# EAGLE design senior_design (EAGLE 8.4.3)
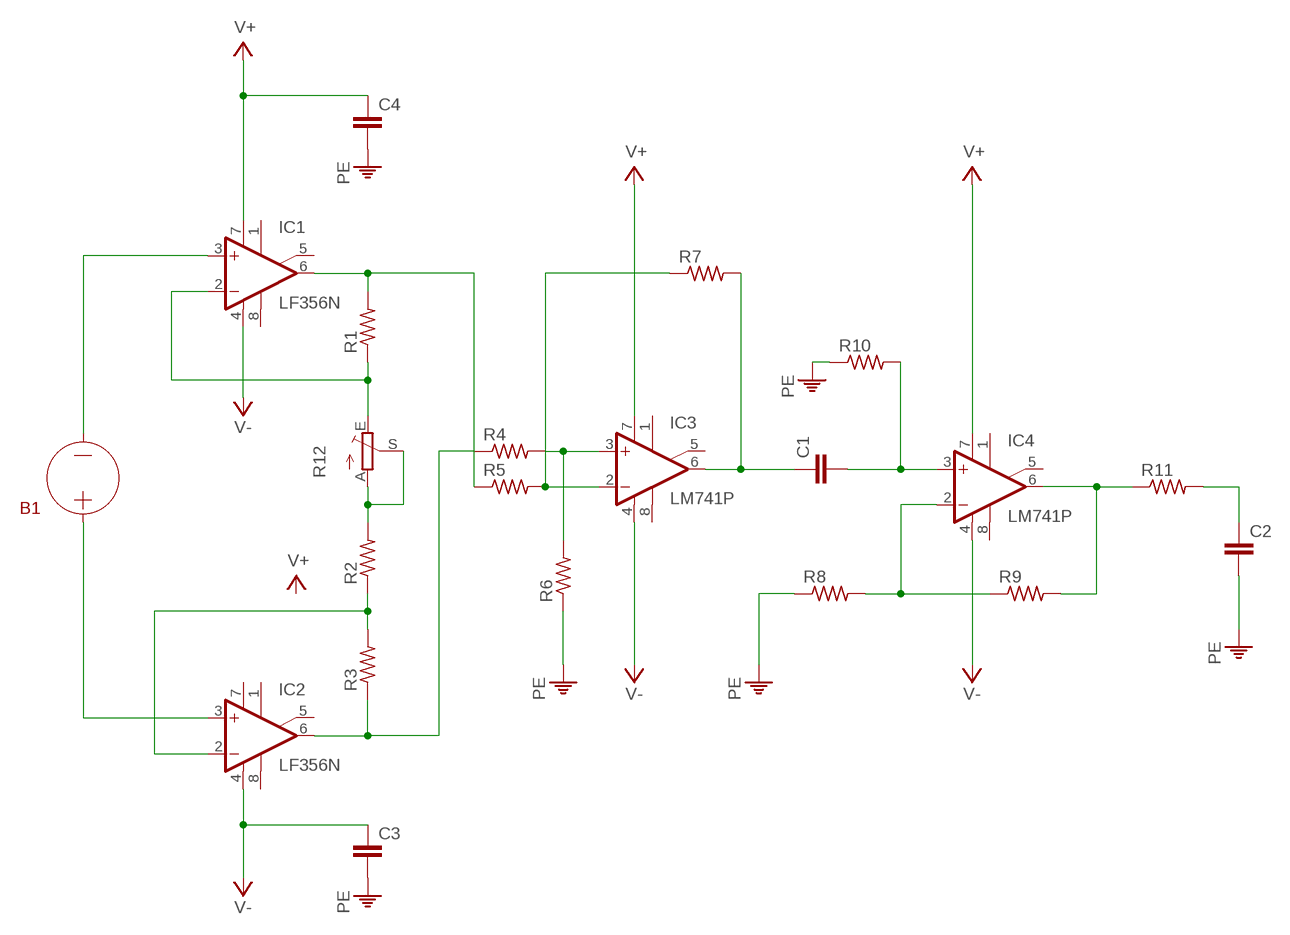
[diagram p0: schematic, sheet 1]

## Parts
B1  NONLIN_ASRC  (no package)
C1  C2,5-3  [C2.5-3]
C2  C2,5-3  [C2.5-3]
C3  C2,5-3  [C2.5-3]
C4  C2,5-3  [C2.5-3]
IC1  LF356N  [DIL08]
IC2  LF356N  [DIL08]
IC3  LM741P  [DIL08]
IC4  LM741P  [DIL08]
R1  R-US_0204/7  [0204/7]
R2  R-US_0204/7  [0204/7]
R3  R-US_0204/7  [0204/7]
R4  R-US_0204/7  [0204/7]
R5  R-US_0204/7  [0204/7]
R6  R-US_0204/7  [0204/7]
R7  R-US_0204/7  [0204/7]
R8  R-US_0204/7  [0204/7]
R9  R-US_0204/7  [0204/7]
R10  R-US_0204/7  [0204/7]
R11  R-US_0204/7  [0204/7]
R12  TRIM_EU-B25X  [B25X]

## Nets
N$1: B1.- IC1.3(+IN)
N$2: B1.+ IC2.3(+IN)
N$3: IC1.6(OUT) R1.2 R5.1
N$4: IC1.2(-IN) R1.1 R12.E
N$5: IC2.6(OUT) R3.1 R4.1
N$6: IC2.2(-IN) R2.1 R3.2
N$7: IC3.3(+IN) R4.2 R6.2
N$8: IC3.2(-IN) R5.2 R7.1
N$9: C2.1 R11.2
N$10: C1.2 IC4.3(+IN) R10.2
N$11: C1.1 IC3.6(OUT) R7.2
N$12: IC4.2(-IN) R8.2 R9.1
N$13: IC4.6(OUT) R9.2 R11.1
N$17: R2.2 R12.A R12.S
V+: C4.1 IC1.7(V+) IC3.7(V+) IC4.7(V+)
V-: C3.1 IC1.4(V-) IC2.4(V-) IC3.4(V-) IC4.4(V-)
VO: C2.2 C3.2 C4.2 R6.1 R8.1 R10.1 ; supply symbol labelled PE
Unconnected: IC1.1(ON1) IC1.5(ON2) IC1.8(OPT) IC2.1(ON1) IC2.5(ON2) IC2.8(OPT) IC3.1(ON1) IC3.5(ON2) IC3.8(OPT) IC4.1(ON1) IC4.5(ON2) IC4.8(OPT)

## Power pins joined to a net without a drawn wire
V+: IC2.7(V+)

## Library data of the parts
B1 = ngspice-simulation:NONLIN_ASRC: Nonlinear dependent source (ASRC) BXXXXXXX n+ n− < i = e x p r > <v= e x p r > < t c 1 = v al u e > < t c 2 = v al u e ><temp= v al u e > <dtemp= v al u e >
C1-C4 = capacitor-wima:C: CAPACITOR naming: grid - package width
IC1 IC2 = linear:LF356: OP AMP
IC3 IC4 = linear:*741: OP AMP
R1-R11 = rcl:R-US_: RESISTOR, American symbol
R12 = pot:TRIM_EU-: POTENTIOMETER

## Board
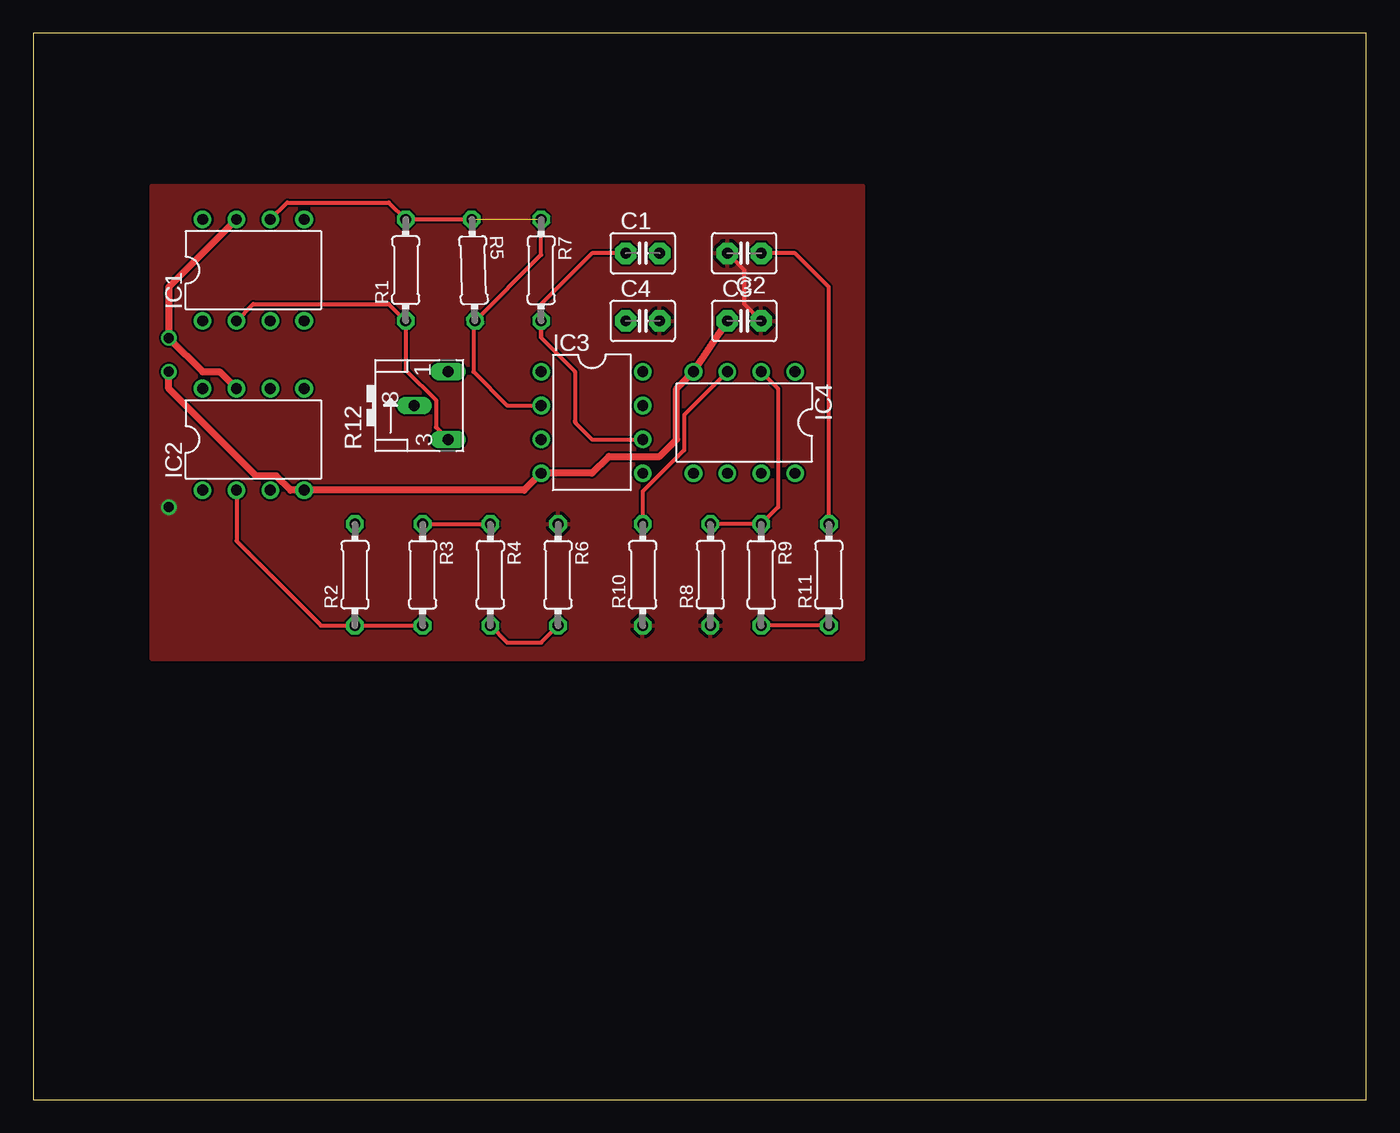
[diagram p1: board, top side]
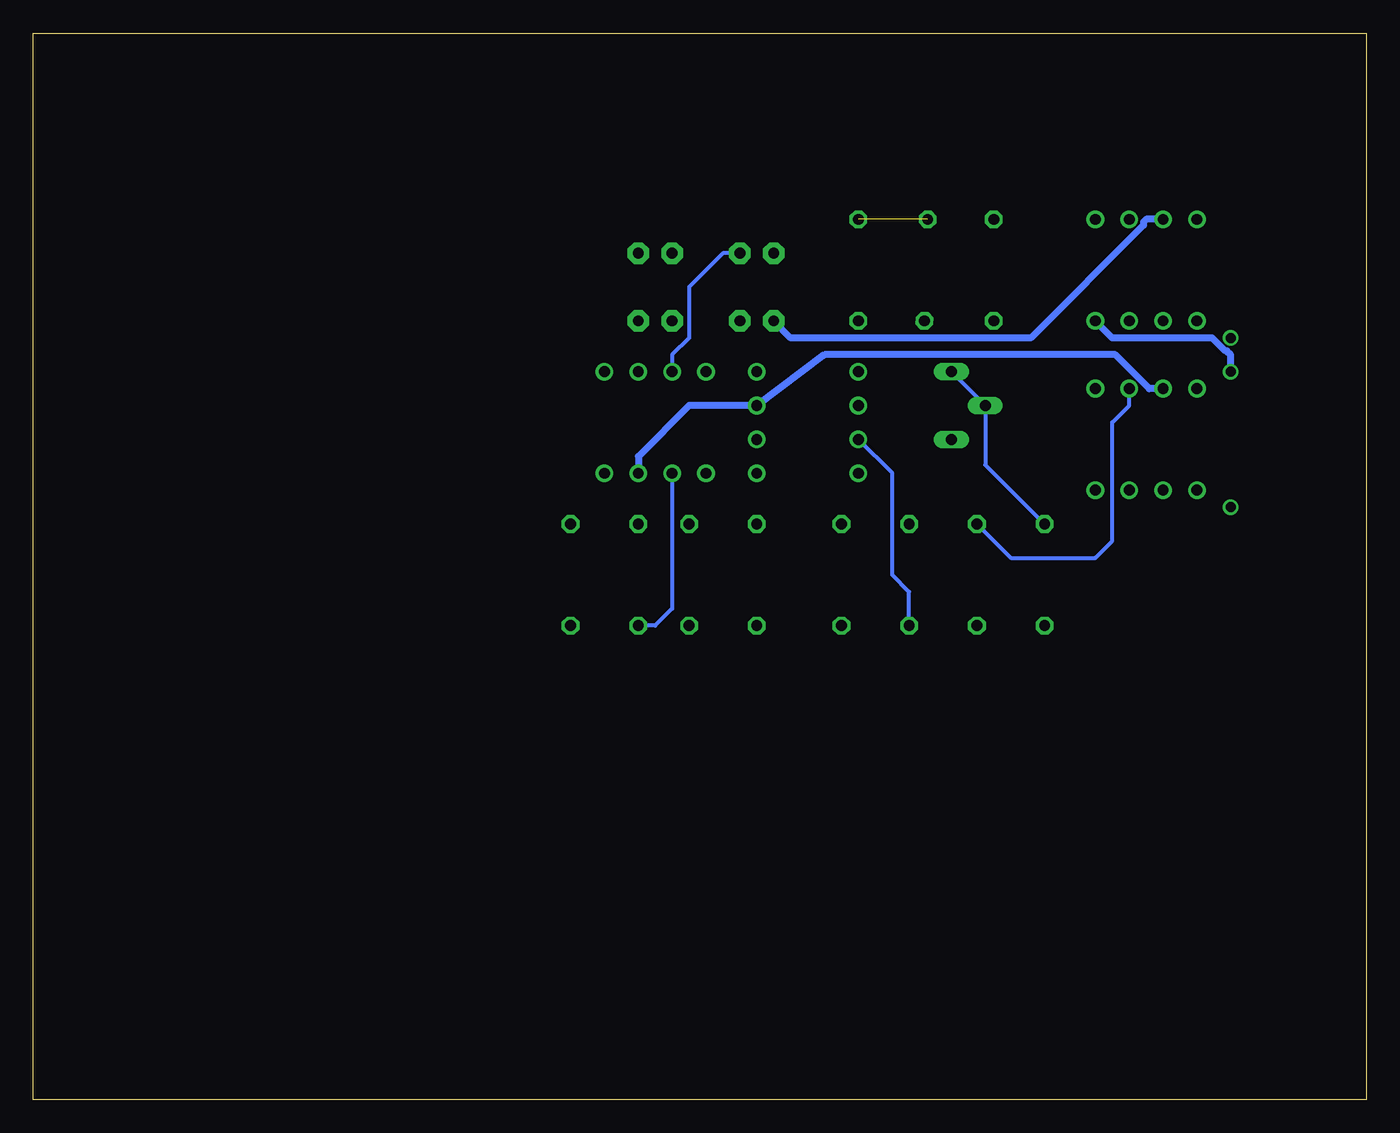
[diagram p2: board, bottom side, seen from below]

Size 100 x 80 mm. Coordinates in mm from the lower left corner, seen from the top.
Outline: 0,0 100,0 100,80 0,80 0,0
Copper layers (1*16): Top 0.035mm / dielectric 1.5mm / Bottom 0.035mm
Design rules "default": minimum track width 6mil, minimum drill 0.35mm, track to track 6mil, track to pad 6mil, pad to pad 6mil, via to via 6mil, smd to smd 6mil, copper to edge 40mil, drill to drill 6mil, minimum pad ring 10mil, minimum via ring 8mil, stop-mask expansion 4mil, vias tented up to drill 0mil, thermal gap 10mil

### Footprints (pad centres in the part's own frame; a part is rotated, then mirrored left to right if it is on the bottom)
C2.5-3 = drill 0.813 pad 1.6 octagon: 1 -1.27,0; 2 1.27,0
DIL08 = drill 0.813 pad 1.27: 1 -3.81,-3.81; 2 -1.27,-3.81; 3 1.27,-3.81; 4 3.81,-3.81; 5 3.81,3.81; 6 1.27,3.81; 7 -1.27,3.81; 8 -3.81,3.81
0204/7 = drill 0.813 octagon: 1 -3.81,0; 2 3.81,0
B25X = drill 0.813 long: A 2.54,-1.905; E -2.54,-1.905; S 0,0.635

### Placement (x,y rotation side)
C1  45.72,63.5 0 top
C2  53.34,63.5 180 top
C3  53.34,58.42 0 top
C4  45.72,58.42 0 top
IC1  16.51,62.23 0 top
IC2  16.51,49.53 0 top
IC3  41.91,50.8 270 top
IC4  53.34,50.8 180 top
R1  27.94,62.23 90 top
R2  24.13,39.37 90 top
R3  29.21,39.37 270 top
R4  34.29,39.37 270 top
R5  33.02,62.23 271.8 top
R6  39.37,39.37 270 top
R7  38.1,62.23 270 top
R8  50.8,39.37 90 top
R9  54.61,39.37 270 top
R10  45.72,39.37 90 top
R11  59.69,39.37 90 top
R12  29.21,52.07 90 top

### Tracks (layer width: path | path; a pad name or v marks a point on that pad's centre or on a via)
N$3  (1 unrouted)
  Top 0.305: R5.1 R1.2 26.67,67.31 19.05,67.31 IC1.6
N$4
  Top 0.305: IC1.2 16.51,59.69 26.67,59.69 R1.1 27.94,54.73 30.2,52.47 30.2,50.44 R12.E
N$5
  Top 0.305: R3.1 R4.1
  Bottom 0.305: R3.1 26.67,40.64 20.32,40.64 19.05,41.91 19.05,50.8 17.78,52.07 IC2.6
N$6
  Top 0.305: IC2.2 15.24,41.91 21.59,35.56 R2.1 R3.2
N$7
  Top 0.305: R4.2 35.56,34.29 38.1,34.29 R6.2
  Bottom 0.305: R4.2 34.29,38.1 35.56,39.37 35.56,46.99 IC3.3
N$8
  Top 0.305: IC3.2 35.56,52.07 33.02,54.61 33.02,58.3 R5.2 38.1,63.38 R7.1
N$9
  Top 0.305: C2.1 57.15,63.5 59.69,60.96 R11.2
N$10
  Top 0.305: R10.2 45.72,45.62 48.82,48.72 48.82,51.36 IC4.3
  Bottom 0.305: C1.2 48.26,63.5 50.8,60.96 50.8,57.15 52.07,55.88 IC4.3
N$11
  Top 0.305: C1.1 41.91,63.5 38.1,59.69 R7.2 | 38.1,57.15 R7.2 | IC3.6 41.91,49.53 40.73,50.71 arc-45 40.64,50.93 40.64,54.61 38.19,57.06 arc-45 38.1,57.28 R7.2
N$12
  Top 0.305: R8.2 R9.1 55.88,44.45 55.88,53.34 IC4.2
N$13
  Top 0.305: R11.1 R9.2
  Bottom 0.305: IC4.6 52.07,36.83 53.34,35.56 R9.2
N$17
  Bottom 0.305: R2.2 28.57,47.62 R12.S R12.A
V+  (via drill 0.75)
  Top 0.508: IC2.7 13.97,54.61 12.7,54.61 v10.16,57.15 10.16,60.96 IC1.7
  Bottom 0.508: IC2.7 16.27,53.34 18.81,55.88 40.64,55.88 IC3.7 50.8,52.07 54.61,48.26 IC4.7 | IC1.7 16.51,66.04 16.71,65.84 16.71,65.6 25.16,57.15 43.18,57.15 C4.1
V-  (via drill 0.75)
  Top 0.508: C3.1 IC4.4 48.26,53.34 48.26,49.53 46.99,48.26 43.18,48.26 41.91,46.99 IC3.4 36.83,45.72 IC2.4 19.29,45.72 18.22,46.79 16.71,46.79 10.16,53.34 v10.16,54.61
  Bottom 0.508: IC1.4 19.05,57.15 11.55,57.15 10.57,56.16 10.45,56.16 10.16,55.88 v10.16,54.61
VO  (via drill 0.75)
  Top 0.305: C3.2 53.34,59.69 53.34,62.23 C2.2
  other vias: 10.16,44.45
  pour Top: 8.89,33.02 8.89,68.58 62.23,68.58 62.23,33.02

### Text on the board
_tNames: R5 | R7 | C1 | C2 | R1 | C4 | C3 | IC1 | IC3 | IC4 | R12 | IC2 | R3 | R4 | R6 | R9 | R2 | R10 | R8 | R11